# EAGLE design sd_logger (EAGLE 6.1)
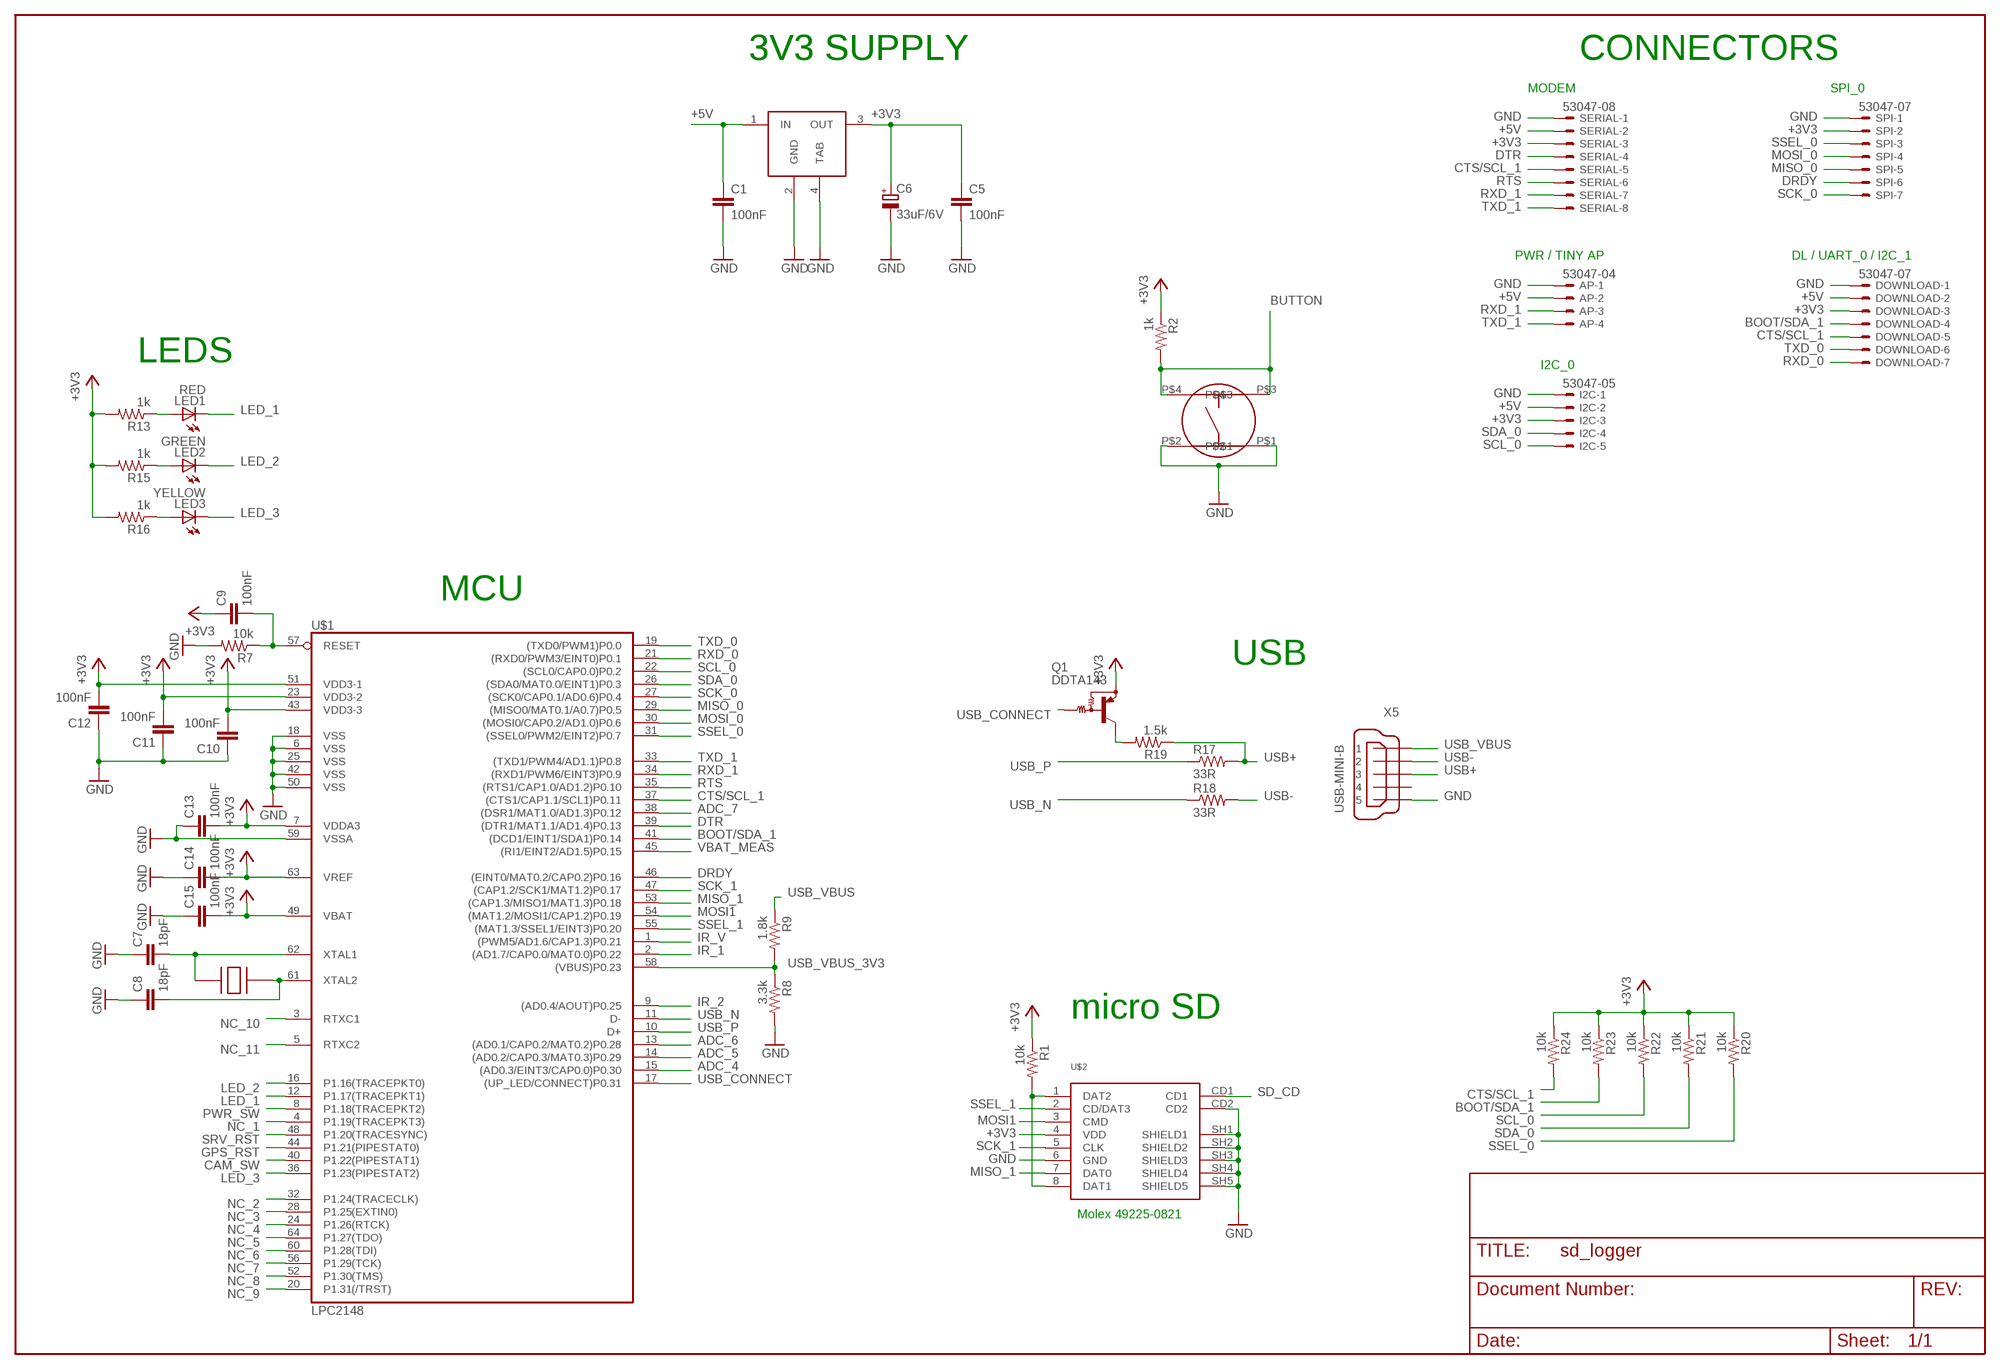
[diagram p0: schematic, sheet 1]

## Parts
AP  53047-04  [53047-04]
C1  100nF  C-EUC0603  [C0603]
C5  100nF  C-EUC0603  [C0603]
C6  33uF/6V  CPOL-EUCT3216  [CT3216]
C7  18pF  C-EUC0603  [C0603]
C8  18pF  C-EUC0603  [C0603]
C9  100nF  C-EUC0603  [C0603]
C10  100nF  C-EUC0603  [C0603]
C11  100nF  C-EUC0603  [C0603]
C12  100nF  C-EUC0603  [C0603]
C13  100nF  C-EUC0603  [C0603]
C14  100nF  C-EUC0603  [C0603]
C15  100nF  C-EUC0603  [C0603]
DOWNLOAD  53047-07  [53047-07]
I2C  53047-05  [53047-05]
LED1  RED  LEDCHIP-LED0805  [CHIP-LED0805]
LED2  GREEN  LEDCHIP-LED0805  [CHIP-LED0805]
LED3  YELLOW  LEDCHIP-LED0805  [CHIP-LED0805]
Q1  DDTA143  MUN2111T1  [SC59-BEC]
R1  10k  R-US_R0603  [R0603@1]
R2  1k  R-US_R0603  [R0603@1]
R7  10k  R-US_R0603  [R0603@1]
R8  3.3k  R-US_R0603  [R0603@1]
R9  1.8k  R-US_R0603  [R0603@1]
R13  1k  R-US_R0603  [R0603@1]
R15  1k  R-US_R0603  [R0603@1]
R16  1k  R-US_R0603  [R0603@1]
R17  33R  R-US_R0603  [R0603@1]
R18  33R  R-US_R0603  [R0603@1]
R19  1.5k  R-US_R0603  [R0603@1]
R20  10k  R-US_R0603  [R0603@1]
R21  10k  R-US_R0603  [R0603@1]
R22  10k  R-US_R0603  [R0603@1]
R23  10k  R-US_R0603  [R0603@1]
R24  10k  R-US_R0603  [R0603@1]
SERIAL  53047-08  [53047-08]
SPI  53047-07  [53047-07]
SW1  B3S  [B3S]
U$1  LPC2148  [SQFP-S-10X10-64]
U$2  MICRO_SD  [SD-MOLEX-49225]
U$3  LM3940IMP-3.3  [SOT223-R]
U$4  CRYSTAL_CTS  [CTS_CRYSTAL]
X5  USB-MINI-B  MINI-USB-UX60-MB-5ST  [UX60-MB-5ST]

## Nets
+3V3: C5.1 C6.+ C9.1 C10.2 C11.2 C12.2 C13.2 C14.2 C15.2 DOWNLOAD.3 I2C.3 Q1.E R1.1 R2.1 R13.2 R15.2 R16.2 R20.1 R21.1 R22.1 R23.1 R24.1 SERIAL.3 SPI.2 U$1.7(VDDA3) U$1.23(VDD3-2) U$1.43(VDD3-3) U$1.49(VBAT) U$1.51(VDD3-1) U$1.63(VREF) U$2.4(VDD) U$3.3(OUT)
+5V: AP.2 C1.1 DOWNLOAD.2 I2C.2 SERIAL.2 U$3.1(IN)
ADC_4: U$1.15((AD0.3/EINT3/CAP0.0)P0.30)
ADC_5: U$1.14((AD0.2/CAP0.3/MAT0.3)P0.29)
ADC_6: U$1.13((AD0.1/CAP0.2/MAT0.2)P0.28)
ADC_7: U$1.38((DSR1/MAT1.0/AD1.3)P0.12)
BOOT/SDA_1: DOWNLOAD.4 R23.2 U$1.41((DCD1/EINT1/SDA1)P0.14)
BUTTON: R2.2 SW1.P$3 SW1.P$4
CAM_SW: U$1.40(P1.22(PIPESTAT1))
CTS/SCL_1: DOWNLOAD.5 R24.2 SERIAL.5 U$1.37((CTS1/CAP1.1/SCL1)P0.11)
DRDY: SPI.6 U$1.46((EINT0/MAT0.2/CAP0.2)P0.16)
DTR: SERIAL.4 U$1.39((DTR1/MAT1.1/AD1.4)P0.13)
GND: AP.1 C1.2 C5.2 C6.- C7.1 C8.1 C10.1 C11.1 C12.1 C13.1 C14.1 C15.1 DOWNLOAD.1 I2C.1 R7.2 R8.2 SERIAL.1 SPI.1 SW1.P$1 SW1.P$2 U$1.6(VSS) U$1.18(VSS) U$1.25(VSS) U$1.42(VSS) U$1.50(VSS) U$1.59(VSSA) U$2.6(GND) U$2.CD2 U$2.SH1(SHIELD1) U$2.SH2(SHIELD2) U$2.SH3(SHIELD3) U$2.SH4(SHIELD4) U$2.SH5(SHIELD5) U$3.2(GND) U$3.4(TAB) X5.5
GPS_RST: U$1.44(P1.21(PIPESTAT0))
IR_1: U$1.2((AD1.7/CAP0.0/MAT0.0)P0.22)
IR_2: U$1.9((AD0.4/AOUT)P0.25)
IR_V: U$1.1((PWM5/AD1.6/CAP1.3)P0.21)
LED_1: LED1.C U$1.12(P1.17(TRACEPKT1))
LED_2: LED2.C U$1.16(P1.16(TRACEPKT0))
LED_3: LED3.C U$1.36(P1.23(PIPESTAT2))
LPC_RESET: C9.2 R7.1 U$1.57(RESET)
MISO_0: SPI.5 U$1.29((MISO0/MAT0.1/A0.7)P0.5)
MISO_1: U$1.53((CAP1.3/MISO1/MAT1.3)P0.18) U$2.7(DAT0)
MOSI1: U$1.54((MAT1.2/MOSI1/CAP1.2)P0.19) U$2.3(CMD)
MOSI_0: SPI.4 U$1.30((MOSI0/CAP0.2/AD1.0)P0.6)
N$1: LED1.A R13.1
N$2: C7.2 U$1.62(XTAL1) U$4.P$1
N$4: C8.2 U$1.61(XTAL2) U$4.P$3
N$6: LED2.A R15.1
N$7: LED3.A R16.1
N$8: R1.2 U$2.1(DAT2) U$2.8(DAT1)
N$14: Q1.C R19.2
NC_1: U$1.4(P1.19(TRACEPKT3))
NC_2: U$1.32(P1.24(TRACECLK))
NC_3: U$1.28(P1.25(EXTIN0))
NC_4: U$1.24(P1.26(RTCK))
NC_5: U$1.64(P1.27(TDO))
NC_6: U$1.60(P1.28(TDI))
NC_7: U$1.56(P1.29(TCK))
NC_8: U$1.52(P1.30(TMS))
NC_9: U$1.20(P1.31(/TRST))
NC_10: U$1.3(RTXC1)
NC_11: U$1.5(RTXC2)
PWR_SW: U$1.8(P1.18(TRACEPKT2))
RTS: SERIAL.6 U$1.35((RTS1/CAP1.0/AD1.2)P0.10)
RXD_0: DOWNLOAD.7 U$1.21((RXD0/PWM3/EINT0)P0.1)
RXD_1: AP.3 SERIAL.7 U$1.34((RXD1/PWM6/EINT3)P0.9)
SCK_0: SPI.7 U$1.27((SCK0/CAP0.1/AD0.6)P0.4)
SCK_1: U$1.47((CAP1.2/SCK1/MAT1.2)P0.17) U$2.5(CLK)
SCL_0: I2C.5 R22.2 U$1.22((SCL0/CAP0.0)P0.2)
SD_CD: U$2.CD1
SDA_0: I2C.4 R21.2 U$1.26((SDA0/MAT0.0/EINT1)P0.3)
SRV_RST: U$1.48(P1.20(TRACESYNC))
SSEL_0: R20.2 SPI.3 U$1.31((SSEL0/PWM2/EINT2)P0.7)
SSEL_1: U$1.55((MAT1.3/SSEL1/EINT3)P0.20) U$2.2(CD/DAT3)
TXD_0: DOWNLOAD.6 U$1.19((TXD0/PWM1)P0.0)
TXD_1: AP.4 SERIAL.8 U$1.33((TXD1/PWM4/AD1.1)P0.8)
USB+: R17.2 R19.1 X5.3
USB-: R18.2 X5.2
USB_CONNECT: Q1.B U$1.17((UP_LED/CONNECT)P0.31)
USB_N: R18.1 U$1.11(D-)
USB_P: R17.1 U$1.10(D+)
USB_VBUS: R9.1 X5.1
USB_VBUS_3V3: R8.1 R9.2 U$1.58((VBUS)P0.23)
VBAT_MEAS: U$1.45((RI1/EINT2/AD1.5)P0.15)
Unconnected: X5.4

## Notes on the sheet
- 3V3 SUPPLY | 3V3 SUPPLY | CONNECTORS
- MODEM | SPI_0
- PWR / TINY AP | DL / UART_0 / I2C_1
- LEDS
- I2C_0
- MCU
- USB
- micro SD
- Molex 49225-0821

## Library data of the parts
AP = con-molex:53?-04: CONNECTOR wire to board 1.25 mm (.049 inch) pitch header
C1 C5 C7-C15 = rcl:C-EU: CAPACITOR, European symbol
C6 = rcl:CPOL-EU: POLARIZED CAPACITOR, European symbol
DOWNLOAD SPI = con-molex:53?-07: CONNECTOR wire to board 1.25 mm (.049 inch) pitch header
I2C = con-molex:53?-05: CONNECTOR wire to board 1.25 mm (.049 inch) pitch header
LED1-LED3 = led:LED: LED OSRAM: - CHIPLED LG R971, LG N971, LY N971, LG Q971, LY Q971, LO R971, LY R971 LH N974, LH R974 LS Q976, LO Q976, LY Q976 LO Q996 - Hyper CHIPLED LW Q18S LB Q993, LB Q99A, LB R99A - SideLED LS A670, LO A670, LY A670, LG A670, LP A670 LB A673, LV A673, LT A673, LW A673 LH A674 LY A675 LS A676, LA A676, LO A676, LY A676, LW A676 LS A679, LY A679, LG A679 - Hyper Micro SIDELED® LS Y876, LA Y876, LO Y876, LY Y876 LT Y87S - SmartLED LW L88C, LW L88S LB L89C, LB L89S, LG L890 LS L89K, LO L89K, LY L89K LS L896, LA L896, LO L896, LY L896 - TOPLED LS T670, LO T670, LY T670, LG T670, LP T670 LSG T670, LSP T670, LSY T670, LOP T670, LYG T670 LG T671, LOG T671, LSG T671 LB T673, LV T673, LT T673, LW T673 LH T674 LS T676, LA T676, LO T676, LY T676, LB T676, LH T676, LSB T676, LW T676 LB T67C, LV T67C, LT T67C, LS T67K, LO T67K, LY T67K, LW E67C LS E67B, LA E67B, LO E67B, LY E67B, LB E67C, LV E67C, LT E67C LW T67C LS T679, LY T679, LG T679 LS T770, LO T770, LY T770, LG T770, LP T770 LB T773, LV T773, LT T773, LW T773 LH T774 LS E675, LA E675, LY E675, LS T675 LS T776, LA T776, LO T776, LY T776, LB T776 LHGB T686 LT T68C, LB T68C - Hyper Mini TOPLED® LB M676 - Mini TOPLED Santana® LG M470 LS M47K, LO M47K, LY M47K Source: http://www.osram.convergy.de - LUMILED® LXK2-PW12-R00, LXK2-PW12-S00, LXK2-PW14-U00, LXK2-PW14-V00 LXK2-PM12-R00, LXK2-PM12-S00, LXK2-PM14-U00 LXK2-PE12-Q00, LXK2-PE12-R00, LXK2-PE12-S00, LXK2-PE14-T00, LXK2-PE14-U00 LXK2-PB12-K00, LXK2-PB12-L00, LXK2-PB12-M00, LXK2-PB14-N00, LXK2-PB14-P00, LXK2-PB14-Q00 LXK2-PR12-L00, LXK2-PR12-M00, LXK2-PR14-Q00, LXK2-PR14-R00 LXK2-PD12-Q00, LXK2-PD12-R00, LXK2-PD12-S00 LXK2-PH12-R00, LXK2-PH12-S00 LXK2-PL12-P00, LXK2-PL12-Q00, LXK2-PL12-R00 Source: www.luxeon.com
Q1 = transistor-pnp:MUN2111*: PNP Bias Resistor Transistor
R1 R2 R7-R9 R13 R15-R24 = rcl:R-US_: RESISTOR, American symbol
SERIAL = con-molex:53?-08: CONNECTOR wire to board 1.25 mm (.049 inch) pitch header
SW1 = paparazzi:B3S
U$1 = paparazzi:LPC2148
U$2 = paparazzi:MICRO_SD
U$3 = paparazzi:LM3940IMP-3.3
U$4 = paparazzi:CRYSTAL_CTS
X5 = con-hirose:MINI-USB-: MINI USB Connector Source: http://www.hirose.co.jp/cataloge_hp/e24000019.pdf

## Board
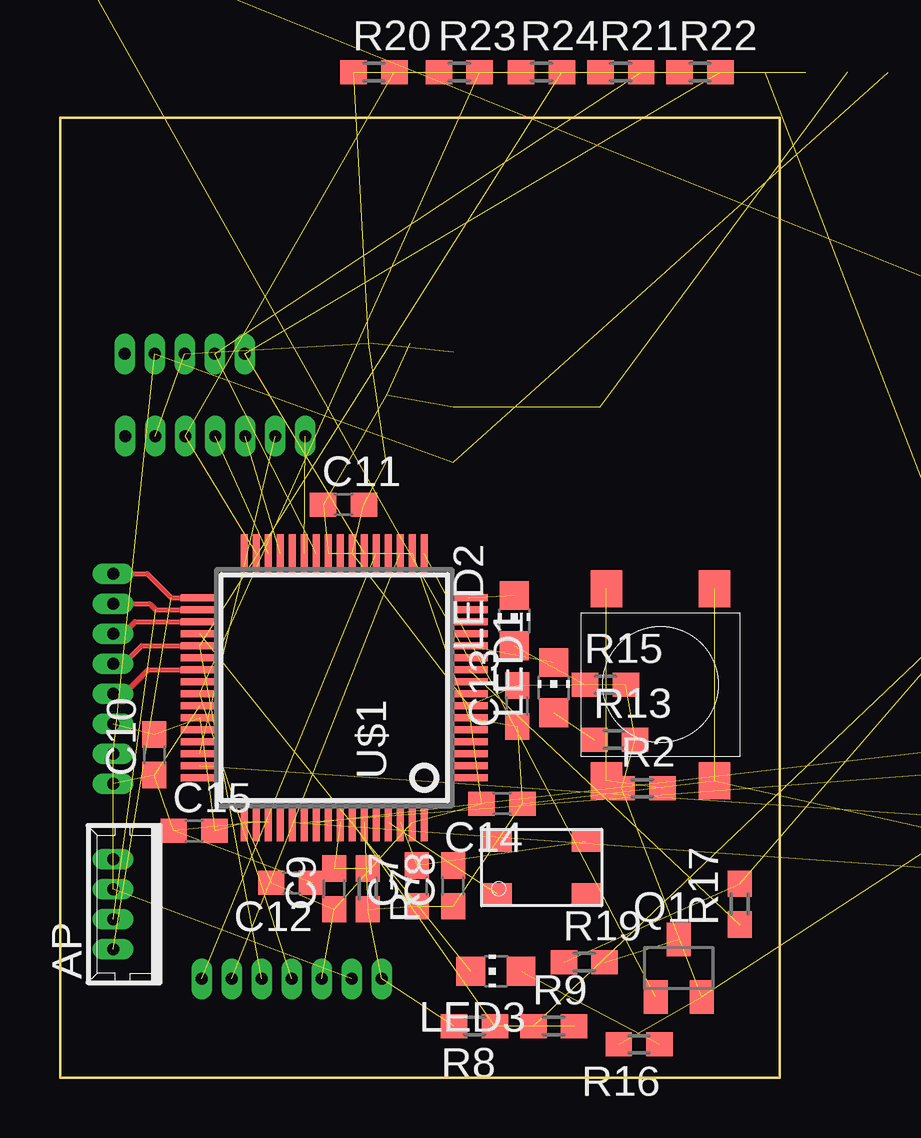
[diagram p1: board, top side]
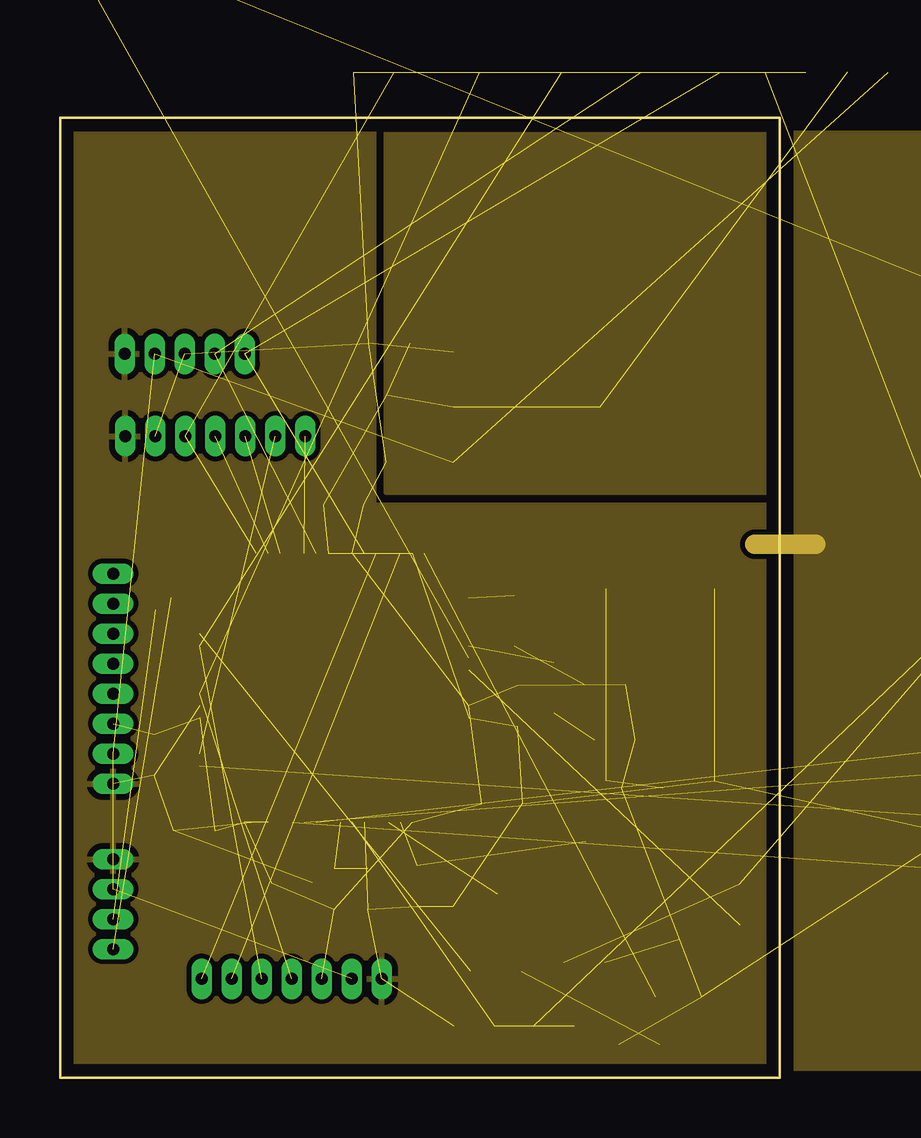
[diagram p2: board, inner layer Route2]
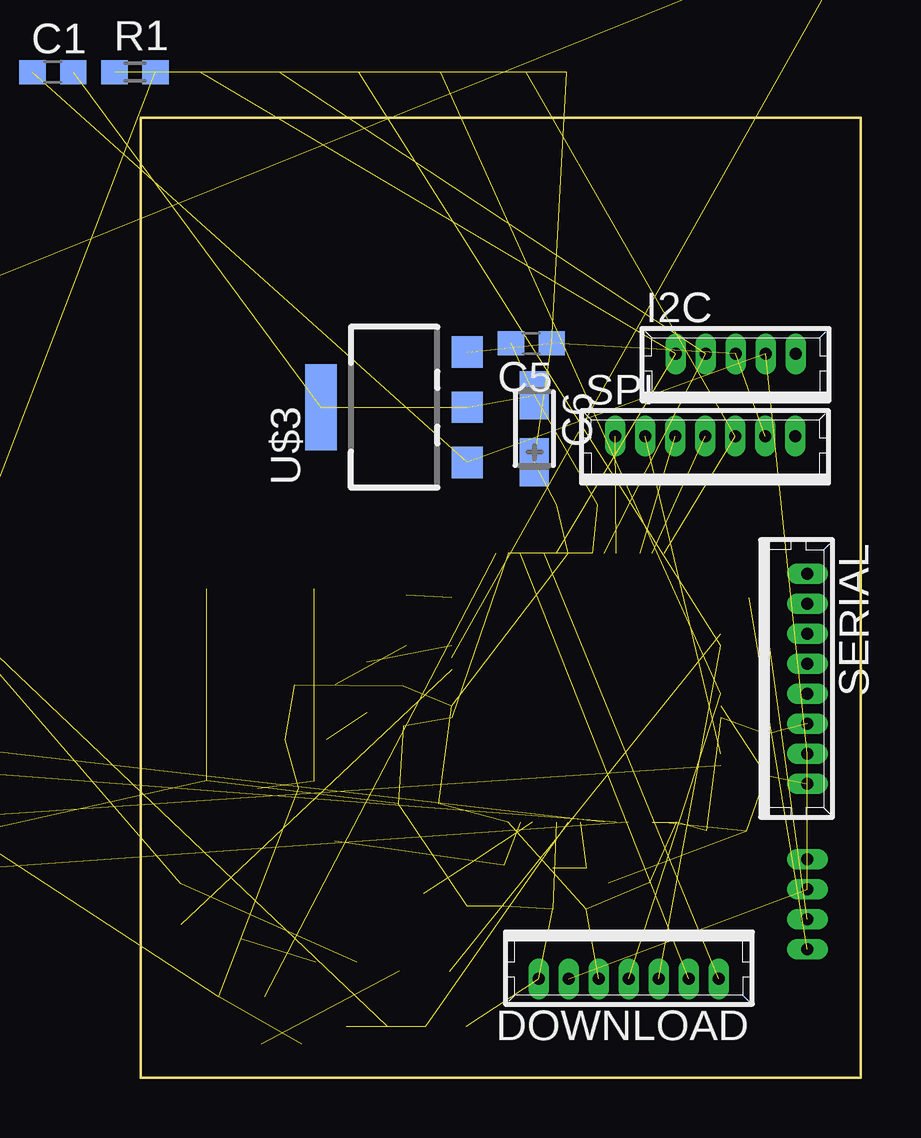
[diagram p3: board, bottom side, seen from below]

Size 30 x 40 mm. Coordinates in mm from the lower left corner, seen from the top.
Outline: 0,0 0,40 30,40 30,0 0,0
Copper layers (1*2+15*16): Top 0.035mm / dielectric 0.2mm / Route2 0.035mm / dielectric 1.5mm / Route15 0.035mm / dielectric 0.2mm / Bottom 0.035mm
Design rules: minimum track width 0.15mm, minimum drill 0.35mm, track to track 0.15mm, track to pad 0.15mm, pad to pad 0.15mm, via to via 0.15mm, smd to smd 0.15mm, copper to edge 20mil, drill to drill 8mil, minimum pad ring 0.177mm, minimum via ring 0.177mm, stop-mask expansion 4mil, vias tented up to drill 0mil, thermal gap 10mil

### Footprints (pad centres in the part's own frame; a part is rotated, then mirrored left to right if it is on the bottom)
53047-04 = drill 0.5 pad 0.698 long: 1 1.875,0.45; 2 0.625,0.45; 3 -0.625,0.45; 4 -1.875,0.45
C0603 = smd 1.1 x 1: 1 -0.85,0; 2 0.85,0
CT3216 = smd 2 x 1.2: + 1.4,0; - -1.4,0
53047-07 = drill 0.5 pad 0.698 long: 1 3.75,0.45; 2 2.5,0.45; 3 1.25,0.45; 4 0,0.45; 5 -1.25,0.45; 6 -2.5,0.45; 7 -3.75,0.45
53047-05 = drill 0.5 pad 0.698 long: 1 2.5,0.45; 2 1.25,0.45; 3 0,0.45; 4 -1.25,0.45; 5 -2.5,0.45
CHIP-LED0805 = smd 1.2 x 1.2: A 0,-1.05; C 0,1.05
SC59-BEC = smd 1 x 1.4: B -0.95,-1.2; C 0,1.2; E 0.95,-1.2
R0603@1 = smd 1.1 x 1: 1 -0.85,0; 2 0.85,0
53047-08 = drill 0.5 pad 0.698 long: 1 4.375,0.45; 2 3.125,0.45; 3 1.875,0.45; 4 0.625,0.45; 5 -0.625,0.45; 6 -1.875,0.45; 7 -3.125,0.45; 8 -4.375,0.45
B3S = smd 1.55 x 1.3: P$1 4,-2.25; P$2 -4,-2.25; P$3 4,2.25; P$4 -4,2.25
SQFP-S-10X10-64 = smd 0.3 x 1.6: 1 -3.75,-5.6; 2 -3.25,-5.6; 3 -2.75,-5.6; 4 -2.25,-5.6; 5 -1.75,-5.6; 6 -1.25,-5.6; 7 -0.75,-5.6; 8 -0.25,-5.6; 9 0.25,-5.6; 10 0.75,-5.6; 11 1.25,-5.6; 12 1.75,-5.6; 13 2.25,-5.6; 14 2.75,-5.6; 15 3.25,-5.6; 16 3.75,-5.6; 33 3.75,5.6; 34 3.25,5.6; 35 2.75,5.6; 36 2.25,5.6; 37 1.75,5.6; 38 1.25,5.6; 39 0.75,5.6; 40 0.25,5.6; 41 -0.25,5.6; 42 -0.75,5.6; 43 -1.25,5.6; 44 -1.75,5.6; 45 -2.25,5.6; 46 -2.75,5.6; 47 -3.25,5.6; 48 -3.75,5.6 | smd 1.6 x 0.3: 17 5.6,-3.75; 18 5.6,-3.25; 19 5.6,-2.75; 20 5.6,-2.25; 21 5.6,-1.75; 22 5.6,-1.25; 23 5.6,-0.75; 24 5.6,-0.25; 25 5.6,0.25; 26 5.6,0.75; 27 5.6,1.25; 28 5.6,1.75; 29 5.6,2.25; 30 5.6,2.75; 31 5.6,3.25; 32 5.6,3.75; 49 -5.6,3.75; 50 -5.6,3.25; 51 -5.6,2.75; 52 -5.6,2.25; 53 -5.6,1.75; 54 -5.6,1.25; 55 -5.6,0.75; 56 -5.6,0.25; 57 -5.6,-0.25; 58 -5.6,-0.75; 59 -5.6,-1.25; 60 -5.6,-1.75; 61 -5.6,-2.25; 62 -5.6,-2.75; 63 -5.6,-3.25; 64 -5.6,-3.75
SD-MOLEX-49225 = smd 0.8 x 1.8: 1 -10.54,16.7; 2 -9.44,16.7; 3 -8.34,16.7; 4 -7.24,16.7; 5 -6.14,16.7; 6 -5.04,16.7; 7 -3.94,16.7; 8 -2.84,16.7 | smd 1.55 x 2.8: CD1 -0.775,14.1 | smd 1.55 x 2.1: CD2 -0.775,6.4 | smd 1.7 x 2.2: SH1 -0.85,1.8; SH5 -15.45,0.8 | smd 1.6 x 1.55: SH2 -12.64,16.425 | smd 1.7 x 3.4: SH3 -16.15,15.3 | smd 1.7 x 3.6: SH4 -16.15,5.75
SOT223-R = smd 1.3 x 1.3: 1 -2.3,-3.05; 2 0,-3.05; 3 2.3,-3.05 | smd 3.6 x 1.3: 4 0,3.05
CTS_CRYSTAL = smd 1.2 x 0.9: P$1 -1.85,-1.1; P$2 1.85,-1.1; P$3 1.85,1.1; P$4 -1.85,1.1
UX60-MB-5ST = smd 2 x 0.5: 1 2.25,1.6; 2 2.25,0.8; 3 2.25,0; 4 2.25,-0.8; 5 2.25,-1.6 | smd 2.2 x 2.5: M1 -3.3,-4.2; M2 -3.3,4.2; M3 2,4.2; M4 2,-4.2 | hole 0.9: 0,-1.75; 0,1.75

### Placement (x,y rotation side)
AP  2.67,7.24 90 top
C1  33.66,41.91 0 bottom
C5  13.72,30.61 180 bottom
C6  13.59,27.05 270 bottom
C7  14.86,8 90 top
C8  16.38,8 90 top
C9  11.43,7.87 90 top
C10  3.94,13.46 90 top
C11  11.81,23.88 0 top
C12  9.65,8.13 180 top
C13  19.05,15.49 90 top
C14  18.41,11.43 180 top
C15  5.59,10.29 0 top
DOWNLOAD  9.65,4.57 180 bottom
I2C  5.21,29.72 0 bottom
LED1  20.57,16.26 0 top
LED2  18.92,19.05 0 top
LED3  18.16,4.45 90 top
Q1  25.78,4.57 0 top
R1  30.23,41.91 0 bottom
R2  24.26,12.06 0 top
R7  12.83,7.87 270 top
R8  17.27,2.16 180 top
R9  20.57,2.16 0 top
R13  23.11,14.1 0 top
R15  22.73,16.38 0 top
R16  24.13,1.4 180 top
R17  28.32,7.24 90 top
R18  1.14,46.61 90 bottom  (outside the outline)
R19  21.84,4.83 0 top
R20  13.08,41.91 0 top
R21  23.37,41.91 0 top
R22  26.67,41.91 0 top
R23  16.64,41.91 0 top
R24  20.07,41.91 0 top
SERIAL  2.67,16.64 270 bottom
SPI  6.48,26.29 0 bottom
SW1  25.02,16.38 90 top
U$1  11.43,16.26 90 top
U$2  56.39,4.57 270 bottom  (outside the outline)
U$3  19.43,27.94 90 bottom
U$4  20.07,8.76 180 top
X5  49.28,29.72 180 top  (outside the outline)

### Tracks (layer width: path | path; a pad name or v marks a point on that pad's centre or on a via)
+3V3  (31 unrouted)
+5V  (5 unrouted)
AGND
  Route2 0.813: 28.96,22.23 31.5,22.23
  pour Route2 (isolate 0.203): 30.35,39.37 51.31,39.37 51.31,22.61 arc90 48.77,20.07 arc90 51.31,17.53 51.31,0.38 30.35,0.38
  pour Route2 (isolate 0.203): 51.31,39.37 69.6,39.37 69.6,0.38 51.31,0.38 51.31,17.53 arc90 53.85,20.07 arc90 51.31,22.61
  pour Route2 (no thermals): 29.59,24.38 13.59,24.38 13.59,39.37 29.59,39.37
BOOT/SDA_1  (2 unrouted)
BUTTON  (2 unrouted)
CTS/SCL_1  (2 unrouted)
  Top 0.203: SERIAL.5 2.66,17.26 3.4,18.01 U$1.37
DRDY  (1 unrouted)
DTR
  Top 0.203: SERIAL.4 2.68,16.01 3.67,17.01 U$1.39
GND  (31 unrouted)
  pour Route2 (isolate 0.203): 0.25,39.62 13.08,39.62 13.08,23.88 29.59,23.88 29.59,0.38 0.25,0.38
LED_1  (1 unrouted)
LED_2  (1 unrouted)
LED_3  (1 unrouted)
LPC_RESET  (2 unrouted)
MISO_0  (1 unrouted)
MISO_1  (1 unrouted)
MOSI1  (1 unrouted)
MOSI_0  (1 unrouted)
N$1  (1 unrouted)
N$2  (2 unrouted)
N$4  (2 unrouted)
N$6  (1 unrouted)
N$7  (1 unrouted)
N$8  (2 unrouted)
N$14  (1 unrouted)
RTS
  Top 0.203: SERIAL.6 2.64,18.51 3.13,19.01 U$1.35
RXD_0  (1 unrouted)
RXD_1  (1 unrouted)
  Top 0.203: SERIAL.7 3.73,19.76 3.99,19.51 U$1.34
SCK_0  (1 unrouted)
SCK_1  (1 unrouted)
SCL_0  (2 unrouted)
SDA_0  (2 unrouted)
SSEL_0  (2 unrouted)
SSEL_1  (1 unrouted)
TXD_0  (1 unrouted)
TXD_1  (1 unrouted)
  Top 0.203: U$1.33 4.63,20.01 3.63,21.01 SERIAL.8
USB+  (2 unrouted)
USB-  (1 unrouted)
USB_CONNECT  (1 unrouted)
USB_N  (1 unrouted)
USB_P  (1 unrouted)
USB_VBUS  (1 unrouted)
USB_VBUS_3V3  (2 unrouted)